# Altium project 1166V31.PrjPCB (part 2 of 2)

## Sheet 1166V31-4.SchDoc: Half-Bridge Phase 3
size A3; Author: M. Kutzsche; Organization: Kübrich Ing.-Gesellschaft; Address1: mbH & Co. KG; Address2: Weißmühle 10; Address3: D-96170 Priesendorf; DocumentNumber: UltraZohm; Revision: 31; SheetNumber: 4; SheetTotal: 5
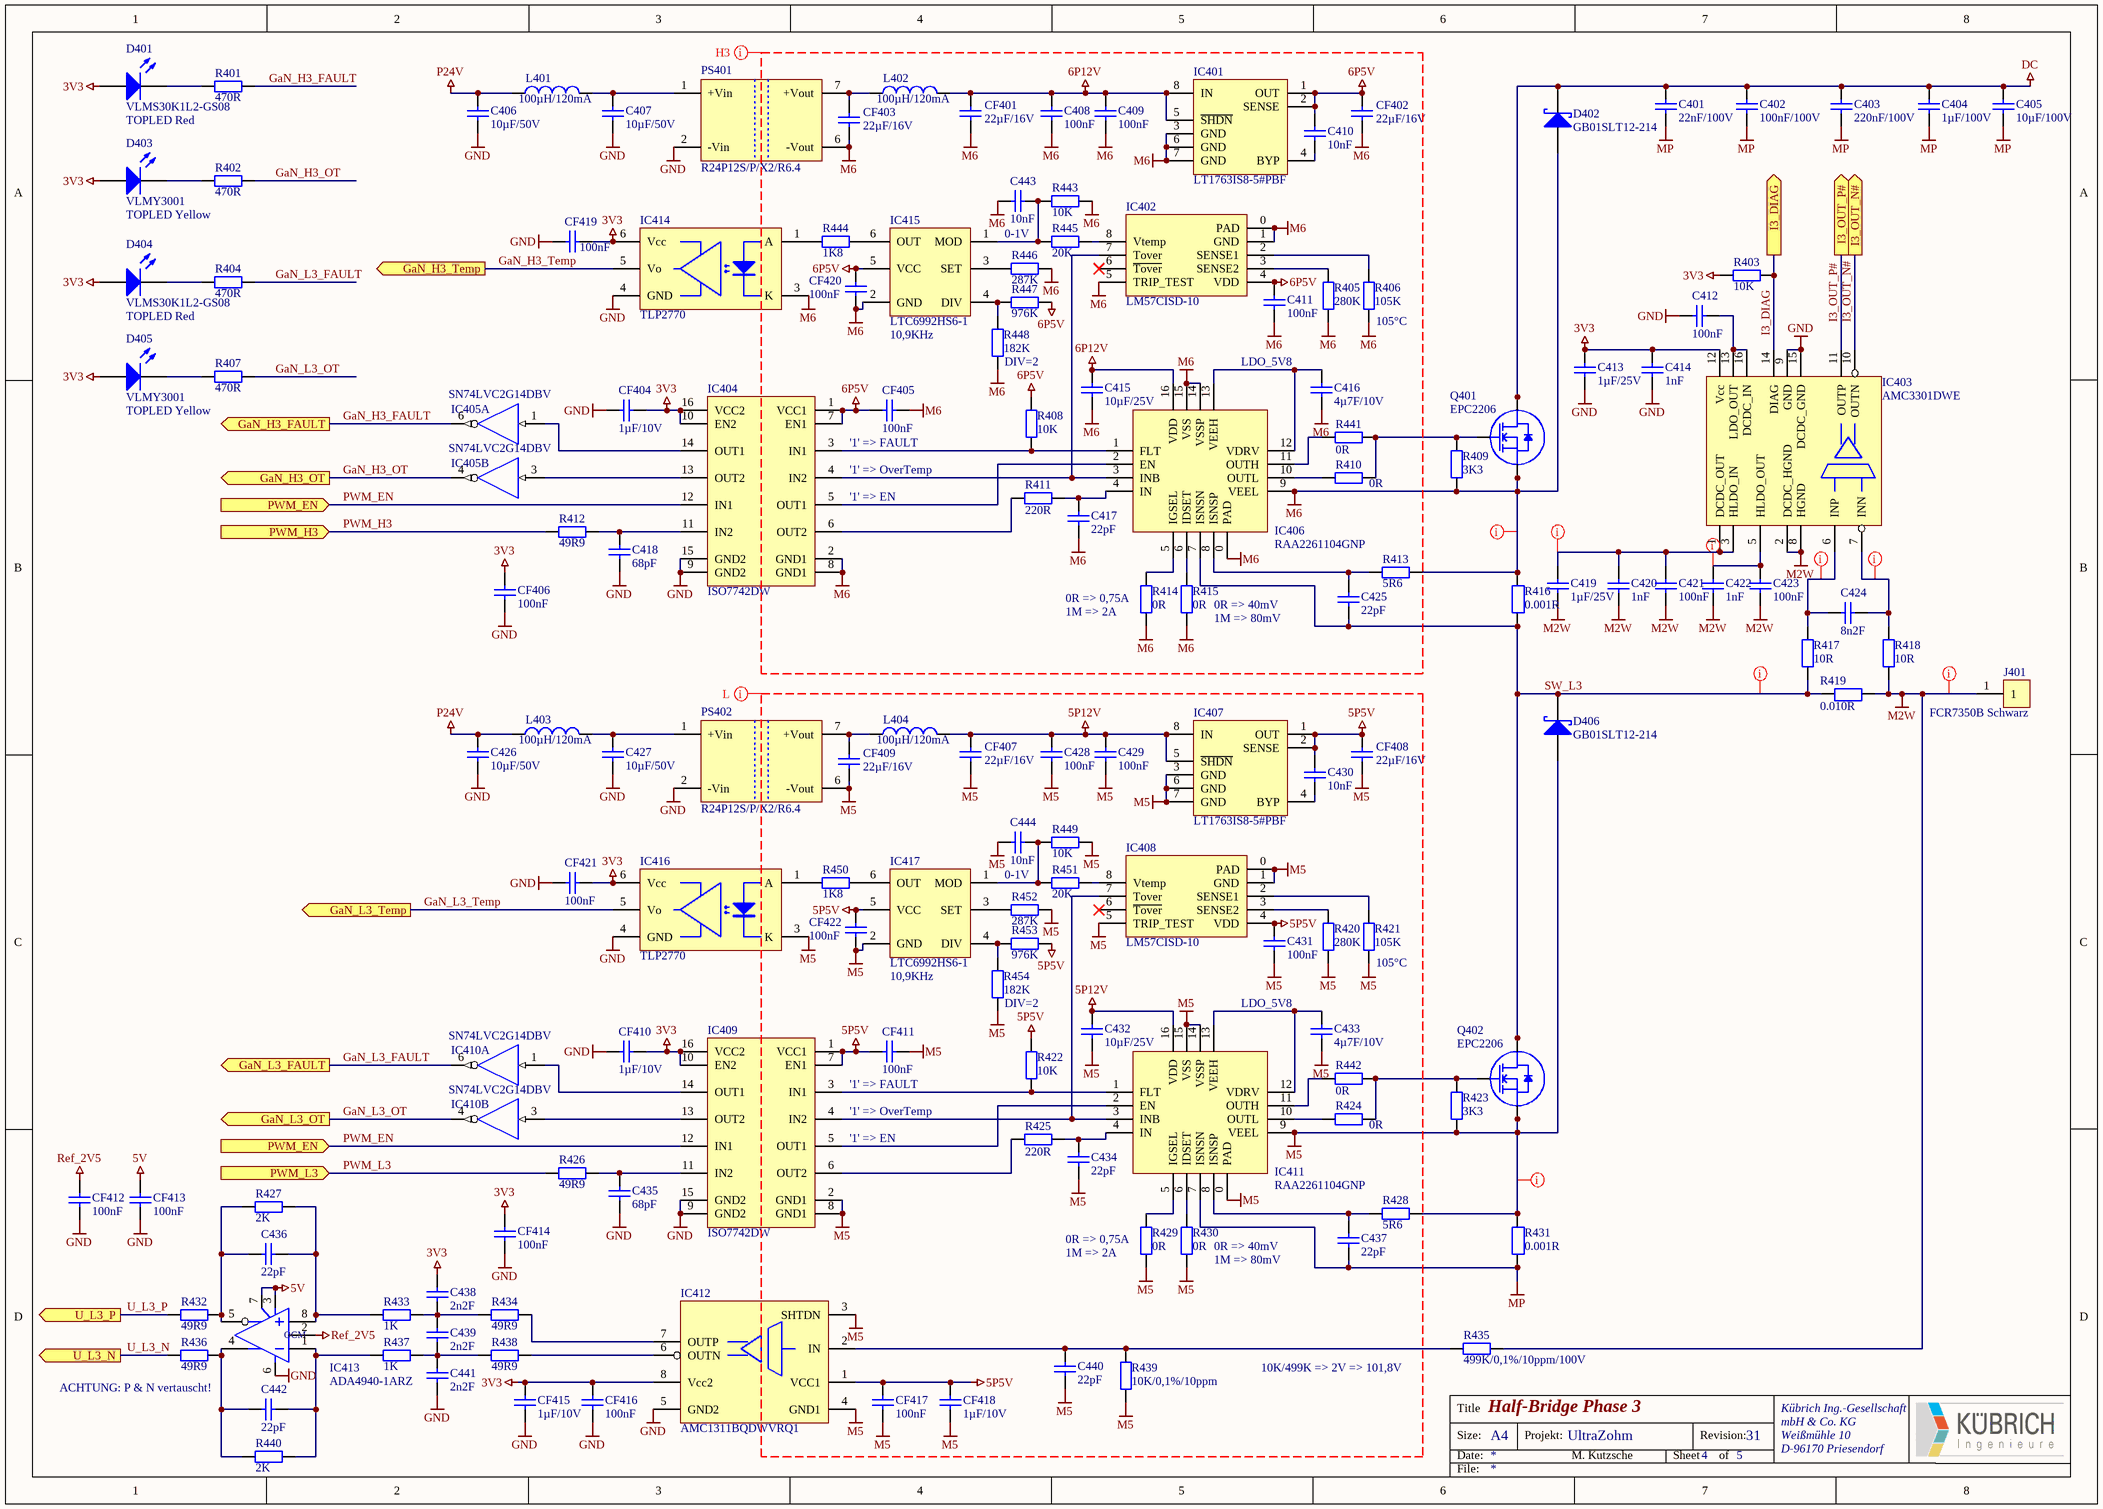
[diagram p3: 1166V31-4.SchDoc]

### Parts
C401  22nF/100V  [0805-Cap]
C402  100nF/100V  [0805-Cap]
C403  220nF/100V  [0805-Cap]
C404  1µF/100V  [0805-Cap]
C405  10µF/100V  [1210-Cap]
C406  10µF/50V  [1206-Cap]
C407  10µF/50V  [1206-Cap]
C408  100nF  [0603-Cap]
C409  100nF  [0603-Cap]
C410  10nF  [0603-Cap]
C411  100nF  [0603-Cap]
C412  100nF  [0603-Cap]
C413  1µF/25V  [1206-Cap]
C414  1nF  [1206-Cap]
C415  10µF/25V  [0805-Cap]
C416  4µ7F/10V  [0805-Cap]
C417  22pF  [0603-Cap]
C418  68pF  [0603-Cap]
C419  1µF/25V  [0603-Cap]
C420  1nF  [0603-Cap]
C421  100nF  [0603-Cap]
C422  1nF  [1206-Cap]
C423  100nF  [1206-Cap]
C424  8n2F  [0603-Cap]
C425  22pF  [0603-Cap]
C426  10µF/50V  [1206-Cap]
C427  10µF/50V  [1206-Cap]
C428  100nF  [0603-Cap]
C429  100nF  [0603-Cap]
C430  10nF  [0603-Cap]
C431  100nF  [0603-Cap]
C432  10µF/25V  [0805-Cap]
C433  4µ7F/10V  [0805-Cap]
C434  22pF  [0603-Cap]
C435  68pF  [0603-Cap]
C436  22pF  [0603-Cap]
C437  22pF  [0603-Cap]
C438  2n2F  [0603-Cap]
C439  2n2F  [0603-Cap]
C440  22pF  [0603-Cap]
C441  2n2F  [0603-Cap]
C442  22pF  [0603-Cap]
C443  10nF  [0603-Cap]
C444  10nF  [0603-Cap]
CF401  22µF/16V  [0805-Cap]
CF402  22µF/16V  [0805-Cap]
CF403  22µF/16V  [0805-Cap]
CF404  1µF/10V  [0603-Cap]
CF405  100nF  [0603-Cap]
CF406  100nF  [0603-Cap]
CF407  22µF/16V  [0805-Cap]
CF408  22µF/16V  [0805-Cap]
CF409  22µF/16V  [0805-Cap]
CF410  1µF/10V  [0603-Cap]
CF411  100nF  [0603-Cap]
CF412  100nF  [0603-Cap]
CF413  100nF  [0603-Cap]
CF414  100nF  [0603-Cap]
CF415  1µF/10V  [0603-Cap]
CF416  100nF  [0603-Cap]
CF417  100nF  [0603-Cap]
CF418  1µF/10V  [0603-Cap]
CF419  100nF  [0603-Cap]
CF420  100nF  [0603-Cap]
CF421  100nF  [0603-Cap]
CF422  100nF  [0603-Cap]
D401  VLMS30K1L2-GS08  Class II: TOPLED Red  [PLCC-2_rot]
D402  GB01SLT12-214  [DO-214 (SMB)]
D403  VLMY3001  Class II: TOPLED Yellow  [PLCC-2_gelb]
D404  VLMS30K1L2-GS08  Class II: TOPLED Red  [PLCC-2_rot]
D405  VLMY3001  Class II: TOPLED Yellow  [PLCC-2_gelb]
D406  GB01SLT12-214  [DO-214 (SMB)]
IC401  LT1763IS8-5#PBF  [SOIC-8-N]
IC402  LM57CISD-10  [WSON-8 (2.5x2.5mm)]
IC403  AMC3301DWE  [SOIC-16-W - 8.1mm]
IC404  ISO7742DW  [SOIC-16-W - 8.1mm]
IC405  SN74LVC2G14DBV  [SOT-23-6]  (parts A,B of 2)
IC406  RAA2261104GNP  [QFN-16 (4x4mm)]
IC407  LT1763IS8-5#PBF  [SOIC-8-N]
IC408  LM57CISD-10  [WSON-8 (2.5x2.5mm)]
IC409  ISO7742DW  [SOIC-16-W - 8.1mm]
IC410  SN74LVC2G14DBV  [SOT-23-6]  (parts A,B of 2)
IC411  RAA2261104GNP  [QFN-16 (4x4mm)]
IC412  AMC1311BQDWVRQ1  [SOIC-8-W]
IC413  ADA4940-1ARZ  [SOIC-8-N]
IC414  TLP2770  [SO-6L]
IC415  LTC6992HS6-1  [SOT-23-6]
IC416  TLP2770  [SO-6L]
IC417  LTC6992HS6-1  [SOT-23-6]
J401  FCR7350B Schwarz  [SLB4-I/90 - 4mm - Schwarz - CLIFF]
L401  100µH/120mA  [1007-IND (2518)]
L402  100µH/120mA  [1007-IND (2518)]
L403  100µH/120mA  [1007-IND (2518)]
L404  100µH/120mA  [1007-IND (2518)]
PS401  R24P12S/P/X2/R6.4  [SIP-7 Single - X2]
PS402  R24P12S/P/X2/R6.4  [SIP-7 Single - X2]
Q401  EPC2206  [D0232]
Q402  EPC2206  [D0232]
R401  470R  [0603-Res]
R402  470R  [0603-Res]
R403  10K  [0603-Res]
R404  470R  [0603-Res]
R405  280K  [0603-Res]
R406  105K  [0603-Res]
R407  470R  [0603-Res]
R408  10K  [0603-Res]
R409  3K3  [0603-Res]
R410  0R  [0603-Res]
R411  220R  [0603-Res]
R412  49R9  [0603-Res]
R413  5R6  [0603-Res]
R414  0R  [0603-Res]
R415  0R  [0603-Res]
R416  0.001R  [2512]
R417  10R  [0603-Res]
R418  10R  [0603-Res]
R419  0.010R  [GMR320]
R420  280K  [0603-Res]
R421  105K  [0603-Res]
R422  10K  [0603-Res]
R423  3K3  [0603-Res]
R424  0R  [0603-Res]
R425  220R  [0603-Res]
R426  49R9  [0603-Res]
R427  2K  [0603-Res]
R428  5R6  [0603-Res]
R429  0R  [0603-Res]
R430  0R  [0603-Res]
R431  0.001R  [2512]
R432  49R9  [0603-Res]
R433  1K  [0603-Res]
R434  49R9  [0603-Res]
R435  499K/0,1%/10ppm/100V  [0805-Res]
R436  49R9  [0603-Res]
R437  1K  [0603-Res]
R438  49R9  [0603-Res]
R439  10K/0,1%/10ppm  [0603-Res]
R440  2K  [0603-Res]
R441  0R  [0603-Res]
R442  0R  [0603-Res]
R443  10K  [0603-Res]
R444  1K8  [0603-Res]
R445  20K  [0603-Res]
R446  287K  [0603-Res]
R447  976K  [0603-Res]
R448  182K  [0603-Res]
R449  10K  [0603-Res]
R450  1K8  [0603-Res]
R451  20K  [0603-Res]
R452  287K  [0603-Res]
R453  976K  [0603-Res]
R454  182K  [0603-Res]

### Ports
GaN_H3_FAULT (out), GaN_H3_OT (out), GaN_H3_Temp (out), GaN_L3_FAULT (out), GaN_L3_OT (out), GaN_L3_Temp (out), I3_DIAG (out), I3_OUT_N# (out), I3_OUT_P# (out), PWM_EN (in), PWM_H3 (in), PWM_L3 (in), U_L3_N (out), U_L3_P (out)

### Nets
3V3: C413.1 C414.1 C438.2 CF404.1 CF406.1 CF410.1 CF414.1 CF415.1 CF416.1 CF419.2 CF421.2 D401.1(A) D403.1(A) D404.1(A) D405.1(A) IC403.12(Vcc) IC404.10(EN2) IC404.16(VCC2) IC405.5(VCC) IC409.10(EN2) IC409.16(VCC2) IC410.5(VCC) IC412.8(Vcc2) IC414.6(Vcc) IC416.6(Vcc) R403.2  [also labelled VCC]
5P5V: C430.1 C431.1 CF408.1 CF411.2 CF417.1 CF418.1 CF422.1 IC407.1(OUT) IC407.2(SENSE) IC408.4(VDD) IC409.1(VCC1) IC409.7(EN1) IC412.1(VCC1) IC417.5(VCC) R422.1 R453.1
5P12V: C428.1 C429.1 C432.2 CF407.1 IC407.5(~{SHDN}) IC407.8(IN) IC411.16(VDD) L404.2
5V: CF413.1 IC413.3(V+) IC413.7(EN)
6P5V: C410.1 C411.1 CF402.1 CF405.2 CF420.1 IC401.1(OUT) IC401.2(SENSE) IC402.4(VDD) IC404.1(VCC1) IC404.7(EN1) IC415.5(VCC) R408.1 R447.1
6P12V: C408.1 C409.1 C415.2 CF401.1 IC401.5(~{SHDN}) IC401.8(IN) IC406.16(VDD) L402.2
DC: C401.1 C402.1 C403.1 C404.1 C405.1 D402.2(K) Q401.3(D1) Q401.4(D2) Q401.7(D3) Q401.8(D4) Q401.11(D5) Q401.12(D6) Q401.15(D7) Q401.16(D8) Q401.19(D9) Q401.20(D10) Q401.23(D11) Q401.24(D12) Q401.27(D13) Q401.28(D14)
GND: C406.1 C407.1 C412.1 C413.2 C414.2 C418.1 C426.1 C427.1 C435.1 C441.1 CF404.2 CF406.2 CF410.2 CF412.2 CF413.2 CF414.2 CF415.2 CF416.2 CF419.1 CF421.1 IC403.9(GND) IC403.15(DCDC_GND) IC404.9(GND2) IC404.15(GND2) IC405.2(GND) IC409.9(GND2) IC409.15(GND2) IC410.2(GND) IC412.5(GND2) IC413.6(V-) IC414.4(GND) IC416.4(GND) PS401.2(-Vin) PS402.2(-Vin)
M2W: C419.2 C420.2 C421.2 C422.2 C423.2 IC403.2(DCDC_HGND) IC403.8(HGND) J401.1 R418.1 R419.1 R435.2
M5: C428.2 C429.2 C431.2 C432.1 C433.2 C434.1 C440.1 C444.1 CF407.2 CF408.2 CF409.2 CF411.1 CF417.2 CF418.2 CF422.2 D406.1(A) IC407.3(GND) IC407.6(GND) IC407.7(GND) IC408.0(PAD) IC408.1(GND) IC408.5(TRIP_TEST) IC409.2(GND1) IC409.8(GND1) IC411.0(PAD) IC411.9(VEEL) IC411.14(VSSP) IC411.15(VSS) IC412.3(SHTDN) IC412.4(GND1) IC416.3(K) IC417.2(GND) PS402.6(-Vout) Q402.2(S1) Q402.5(S2) Q402.6(S3) Q402.9(S4) Q402.10(S5) Q402.13(S6) Q402.14(S7) Q402.17(S8) Q402.18(S9) Q402.21(S10) Q402.22(S11) Q402.25(S12) Q402.26(S13) Q402.29(S14) Q402.30(Sub) R420.2 R421.2 R423.1 R428.2 R429.2 R430.2 R431.2 R439.2 R449.1 R452.1 R454.1
M6: C408.2 C409.2 C411.2 C415.1 C416.2 C417.1 C443.1 CF401.2 CF402.2 CF403.2 CF405.1 CF420.2 D402.1(A) IC401.3(GND) IC401.6(GND) IC401.7(GND) IC402.0(PAD) IC402.1(GND) IC402.5(TRIP_TEST) IC404.2(GND1) IC404.8(GND1) IC406.0(PAD) IC406.9(VEEL) IC406.14(VSSP) IC406.15(VSS) IC414.3(K) IC415.2(GND) PS401.6(-Vout) Q401.2(S1) Q401.5(S2) Q401.6(S3) Q401.9(S4) Q401.10(S5) Q401.13(S6) Q401.14(S7) Q401.17(S8) Q401.18(S9) Q401.21(S10) Q401.22(S11) Q401.25(S12) Q401.26(S13) Q401.29(S14) Q401.30(Sub) R405.2 R406.2 R409.1 R413.2 R414.2 R415.2 R416.2 R443.1 R446.1 R448.1
MP: C401.2 C402.2 C403.2 C404.2 C405.2 C437.1 IC411.7(ISNSN) R431.1
P24V: C406.2 C426.2 L401.1 L403.1
Ref_2V5: CF412.1 IC413.2(OCM)
GaN_H3_FAULT: IC405.6(1Y) R401.2 ; port GaN_H3_FAULT
GaN_H3_OT: IC405.4(2Y) R402.2 ; port GaN_H3_OT
GaN_H3_Temp: IC414.5(Vo) ; port GaN_H3_Temp
GaN_L3_FAULT: IC410.6(1Y) R404.2 ; port GaN_L3_FAULT
GaN_L3_OT: IC410.4(2Y) R407.2 ; port GaN_L3_OT
GaN_L3_Temp: IC416.5(Vo) ; port GaN_L3_Temp
I3_DIAG: IC403.14(DIAG) R403.1 ; port I3_DIAG
I3_OUT_N#: IC403.10(OUTN) ; port I3_OUT_N#
I3_OUT_P#: IC403.11(OUTP) ; port I3_OUT_P#
PWM_EN: IC404.12(IN1) IC409.12(IN1) ; port PWM_EN
PWM_H3: R412.2 ; port PWM_H3
PWM_L3: R426.2 ; port PWM_L3
SW_L3: C425.1 D406.2(K) IC406.7(ISNSN) Q402.3(D1) Q402.4(D2) Q402.7(D3) Q402.8(D4) Q402.11(D5) Q402.12(D6) Q402.15(D7) Q402.16(D8) Q402.19(D9) Q402.20(D10) Q402.23(D11) Q402.24(D12) Q402.27(D13) Q402.28(D14) R416.1 R417.1 R419.2
U_L3_N: R436.2 ; port U_L3_N
U_L3_P: R432.2 ; port U_L3_P
NetC407_2: C407.2 L401.2 PS401.1(+Vin)
NetC410_2: C410.2 IC401.4(BYP)
NetC412_2: C412.2 IC403.13(LDO_OUT) IC403.16(DCDC_IN)
NetC416_1: C416.1 IC406.12(VDRV) IC406.13(VEEH)
NetC417_2: C417.2 IC406.4(IN) R411.1
NetC418_2: C418.2 IC404.11(IN2) R412.1
NetC419_1: C419.1 C420.1 C421.1 IC403.1(DCDC_OUT) IC403.3(HLDO_IN)
NetC422_1: C422.1 C423.1 IC403.5(HLDO_OUT)
NetC424_1: C424.1 IC403.7(INN) R418.2
NetC424_2: C424.2 IC403.6(INP) R417.2
NetC425_2: C425.2 IC406.8(ISNSP) R413.1
NetC427_2: C427.2 L403.2 PS402.1(+Vin)
NetC430_2: C430.2 IC407.4(BYP)
NetC433_1: C433.1 IC411.12(VDRV) IC411.13(VEEH)
NetC434_2: C434.2 IC411.4(IN) R425.1
NetC435_2: C435.2 IC409.11(IN2) R426.1
NetC436_1: C436.1 IC413.8(+) R427.1 R433.2
NetC436_2: C436.2 IC413.5(Out) R427.2 R432.1
NetC437_2: C437.2 IC411.8(ISNSP) R428.1
NetC438_1: C438.1 C439.2 R433.1 R434.2
NetC439_1: C439.1 C441.2 R437.1 R438.2
NetC440_2: C440.2 IC412.2(IN) R435.1 R439.1
NetC442_1: C442.1 IC413.1(-) R437.2 R440.1
NetC442_2: C442.2 IC413.4(Out) R436.1 R440.2
NetC443_2: C443.2 IC415.1(MOD) R443.2 R445.1
NetC444_2: C444.2 IC417.1(MOD) R449.2 R451.1
NetCF403_1: CF403.1 L402.1 PS401.7(+Vout)
NetCF409_1: CF409.1 L404.1 PS402.7(+Vout)
NetD401_2: D401.2(K) R401.1
NetD403_2: D403.2(K) R402.1
NetD404_2: D404.2(K) R404.1
NetD405_2: D405.2(K) R407.1
NetIC402_2: IC402.2(SENSE1) R406.1
NetIC402_3: IC402.3(SENSE2) R405.1
NetIC402_7: IC402.7(Tover) IC404.4(IN2) IC406.3(INB)
NetIC402_8: IC402.8(Vtemp) R445.2
NetIC404_3: IC404.3(IN1) IC406.1(FLT) R408.2
NetIC404_5: IC404.5(OUT1) IC406.2(EN)
NetIC404_6: IC404.6(OUT2) R411.2
NetIC404_13: IC404.13(OUT2) IC405.3(2A)
NetIC404_14: IC404.14(OUT1) IC405.1(1A)
NetIC406_5: IC406.5(IGSEL) R414.1
NetIC406_6: IC406.6(IDSET) R415.1
NetIC406_10: IC406.10(OUTL) R410.1
NetIC406_11: IC406.11(OUTH) R441.1
NetIC408_2: IC408.2(SENSE1) R421.1
NetIC408_3: IC408.3(SENSE2) R420.1
NetIC408_7: IC408.7(Tover) IC409.4(IN2) IC411.3(INB)
NetIC408_8: IC408.8(Vtemp) R451.2
NetIC409_3: IC409.3(IN1) IC411.1(FLT) R422.2
NetIC409_5: IC409.5(OUT1) IC411.2(EN)
NetIC409_6: IC409.6(OUT2) R425.2
NetIC409_13: IC409.13(OUT2) IC410.3(2A)
NetIC409_14: IC409.14(OUT1) IC410.1(1A)
NetIC411_5: IC411.5(IGSEL) R429.1
NetIC411_6: IC411.6(IDSET) R430.1
NetIC411_10: IC411.10(OUTL) R424.1
NetIC411_11: IC411.11(OUTH) R442.1
NetIC412_6: IC412.6(OUTN) R438.1
NetIC412_7: IC412.7(OUTP) R434.1
NetIC414_1: IC414.1(A) R444.2
NetIC415_3: IC415.3(SET) R446.2
NetIC415_4: IC415.4(DIV) R447.2 R448.2
NetIC415_6: IC415.6(OUT) R444.1
NetIC416_1: IC416.1(A) R450.2
NetIC417_3: IC417.3(SET) R452.2
NetIC417_4: IC417.4(DIV) R453.2 R454.2
NetIC417_6: IC417.6(OUT) R450.1
NetQ401_1: Q401.1(G) R409.2 R410.2 R441.2
NetQ402_1: Q402.1(G) R423.2 R424.2 R442.2

Not connected (* = marked no-connect by the designer): IC402 6(~{Tover})*; IC408 6(~{Tover})*

### Layout directives
net class H3: 6P5V, 6P12V, M2W, M6, NetC419_1, NetC422_1, NetC424_1, NetC424_2, SW_L3
net class L: 5P5V, 5P12V, M5

### Notes on the sheet
- 0-1V
- (near IC415) 10,9KHz
- (near R448) DIV=2
- LDO_5V8
- (near R406) 105°C
- '1' => FAULT
- '1' => OverTemp
- (near IC404) '1' => EN
- (near R414) 1M => 2A
- (near R414) 0R => 0,75A
- (near R415) 0R => 40mV
- (near R415) 1M => 80mV
- (near IC417) 10,9KHz
- (near R421) 105°C
- (near R454) DIV=2
- (near IC409) '1' => EN
- (near R429) 1M => 2A
- (near R429) 0R => 0,75A
- (near R430) 0R => 40mV
- (near R430) 1M => 80mV
- ACHTUNG: P & N vertauscht!
- 10K/499K => 2V => 101,8V
- Title
- Size:
- Date:
- A4
- Projekt:
- Sheet
- Revision:
- of
- File:

### Library data of the parts
C401-C444 CF401-CF422 = Cap_SMD: Capacitor (SMD); Class I: Pasiv; Class II: Capacitor; Last edited: 20.11.2006 10:25
  C401: value: 22nF/100V
  C402: value: 100nF/100V
  C403: value: 220nF/100V
  C404: value: 1µF/100V
  C405: value: 10µF/100V
  C406 C407 C426 C427: value: 10µF/50V
  C408 C409 C411 C412 C421 C423 C428 C429 C431 CF405 CF406 CF411-CF414 CF416 CF417 CF419-CF422: value: 100nF
  C410 C430 C443 C444: value: 10nF
  C413 C419: value: 1µF/25V
  C414 C420 C422: value: 1nF
  C415 C432: value: 10µF/25V
  C416 C433: value: 4µ7F/10V
  C417 C425 C434 C436 C437 C440 C442: value: 22pF
  C418 C435: value: 68pF
  C424: value: 8n2F
  C438 C439 C441: value: 2n2F
  CF401-CF403 CF407-CF409: value: 22µF/16V
  CF404 CF410 CF415 CF418: value: 1µF/10V
D401 D404 = VLMS30K1L2-GS08: Top LED Super red, 2mA, 18mcd, -40-100°C; Manufacturer: Vishay; Class I: Discrete; Best.-Nr.: Farnell 132-8349; Last edited: 23.01.2007 08:58
D402 D406 = GB01SLT12-214: Silicon Carbide Schottky Diode Vr=1200V If=1A; Manufacturer: GeneSiC Semiconductor; Class I: Discret; Package information: Unknown; Best.-Nr.: DigiKey: 1242-1169-1-ND; Class II: Silicon Carbide Schottky Diode Vr=1200V If=1A; Datasheet: Ver. 7 Nov 2000; Package reference: DO-214AA (SMB)
D403 D405 = VLMY3001: Top LED Yellow, 2mA, 18mcd, -40-100°C; Manufacturer: Vishay; Class I: Discrete; Best.-Nr.: ???; Last edited: 23.01.2007 08:58
IC401 IC407 = LT1763IS8-5#PBF: LDO 5V/500mA, Vin 20V (-40-125°C); Manufacturer: Linear Technology; Class I: Discret; Package information: Unknown; Best.-Nr.: Farnell 229-5214; Class II: LDO 5V/500mA, Vin 20V (-40-125°C); Datasheet: ???; Package reference: SO-8
IC402 IC408 = LM57CISD-10: Temperature Sensor/Switch -40 - 150°C, Resistor-Programmable, 10°C Hysterese; Manufacturer: Texas Instruments; Class I: Sensor; Best.-Nr.: DigiKey: LM57CISD-10/NOPBCT-ND; Class II: Temperature Sensor/Switch -40 - 150°C, Resistor-Programmable, 10°C Hysterese
IC403 = AMC3301DWE: ±250 mV Input Voltage Range, Reinforced Isolated Amplifier and High Bandwidth of 300 kHz; Manufacturer: Texas Instruments; Class II: ±250 mV, 300KHz, -40-125°C; Package information: Unknown; Best.-Nr.: DigiKey: 296-AMC3301DWE-ND; Class I: Isolated Amplifier; Datasheet: Unknown; Package reference: SOIC-16-W
IC404 IC409 = ISO7742DW: Quad-CH 100Mbps Isolators 2 IN/2 OUT, 5000V Reinforced, (-40-125°C); Manufacturer: Texas Instruments; Class I: Optocoupler; Package information: Unknown; Best.-Nr.: DigiKey: 296-44609-1-ND; Class II: Quad-CH 100Mbps Isolators 2 IN/2 OUT, 5000V Reinforced, (-40-125°C); Datasheet: Unknown; Package reference: SOIC-16W
IC405 IC410 = SN74LVC2G14D_: Dual Inverter with Schmitt Trigger Input; Manufacturer: Texas Instrument; Class I: Logic; value121: SN74LVC2G14DCK; Datasheet: SCES200J; Class II: Dual Inverter with Schmitt Trigger Input; value111: SN74LVC2G14DBV; Last edited: 22.01.2007 11:08
IC406 IC411 = RAA2261104GNP: Low -Side GaN FET-Driver, 6,5V - 18V; Manufacturer: Renesas; Class I: Discret; Package information: Unknown; Best.-Nr.: Mouser: 968-2261104GNP#AA0; Class II: Low -Side GaN FET-Driver, 6,5V - 18V; Datasheet: Rev. Mar 2002; Package reference: QFN-16
IC412 = AMC1311BQDWVRQ1: 2V Input, Automotive High-Impedance, Reinforced Isolated Amplifier for Voltage Sensing; Manufacturer: Texas Instruments; Class II: 2V, 275KHz, -40-125°C; Package information: Unknown; Best.-Nr.: Mouser: 595-AMC1311BQDWVRQ1; Class I: Isolated Amplifier; Datasheet: Unknown; Package reference: SOIC-8-W
IC413 = ADA4940-1ARZ: Fully Differential ADC Drivers (-40-125°C); Manufacturer: ANALOG DEVICES; Class I: Analog; Best.-Nr.: Farnell 209-6178; Class II: Fully Differential ADC Drivers (-40-125°C); Datasheet: DSO11449, Ver. Aug 2000; Last edited: 04.01.2007 10:14; Package Reference: SOIC-N-8
IC414 IC416 = TLP2770: High-speed 20Mbps Logic Gate Optocoupler; Manufacturer: Toshiba; Package information: Unknown; Best.-Nr.: DigiKey: TLP2770; Class II: High-speed 20Mbps Logic Gate Optocoupler; Class I: Optocoupler; Package reference: SO-6L
IC415 IC417 = LTC6992HS6-1: Analog to PWM Converter 0-100%, -40-125°C; Manufacturer: Analog Device; Best.-Nr.: Mouser: 584-C6992HS6-1TRMPBF; Published: 24-Mar-1999; Revision: July-2002: Re-released for DXP Platform.; Publisher: Altium Limited
J401 = FCR7350B Schwarz: Labor Winkelbuchsen 4mm Schwarz; Manufacturer: CLIFF Electronic; Class I: Connectors; Best.-Nr.: Farnell: 185-4507; Class II: Labor Winkelbuchsen 4mm Schwarz; Last edited: 07.03.2007 13:28
L401-L404 = CB2518T101K: 100µH, 60/120mA. (1007), -40-105°C; Manufacturer: Taiyo Yuden; Class I: Pasive; Best.-Nr.: DigiKey:   587-2192-1-ND; Class II: 100µH, 60/120mA. (1007), -40-105°C; Last edited: 08.12.2006 12:28
PS401 PS402 = R24P12S/P/X2/R6.4: DC/DC Converter 24V to 12V, 1W, 84mA (unregulated) 6,4KVDC Rainforced; Manufacturer: Recom; Class I: Analog; Package information: Unknown; Best.-Nr.: Mouser: 919-R24P12SX2PR6.4; Class II: DC/DC Converter 24V to 12V, 1W, 84mA (unregulated) 6,4KVDC Rainforced; Package reference: SIP-7; Datasheet: Rev. 28 Apr 2002
Q401 Q402 = EPC2206: GaN-Fet 80V, 2.2mOhm, 90A; Manufacturer: EPC; Class I: Discret; Package information: Unknown; Best.-Nr.: DigiKey: 917-1212-1-ND; Class II: GaN-Fet 80V, 2.2mOhm, 90A; Datasheet: Rev. Mar 2002; Package reference: DIE
R401-R415 R417 R418 R420-R430 R432-R454 = Res_SMD: Resistor SMD; Class I: Pasiv; Class II: Resistor; Last edited: 17.11.2006 11:38
  R401 R402 R404 R407: value: 470R
  R403 R408 R422 R443 R449: value: 10K
  R405 R420: value: 280K
  R406 R421: value: 105K
  R409 R423: value: 3K3
  R410 R414 R415 R424 R429 R430 R441 R442: value: 0R
  R411 R425: value: 220R
  R412 R426 R432 R434 R436 R438: value: 49R9
  R413 R428: value: 5R6
  R417 R418: value: 10R
  R427 R440: value: 2K
  R433 R437: value: 1K
  R435: value: 499K/0,1%/10ppm/100V
  R439: value: 10K/0,1%/10ppm
  R444 R450: value: 1K8
  R445 R451: value: 20K
  R446 R452: value: 287K
  R447 R453: value: 976K
  R448 R454: value: 182K
R416 R431 = CSS2H-2512R-1L00F: Shunt 0.001R, 5W, 1%, 50ppm/°C; Manufacturer: Bourns; Class I: Pasiv; Class II: Shunt 5W; Best.-Nr.: Farnell 257-6347; Last edited: 23.11.2010 14:12; value: 0.001R
R419 = GMR320HJBFA10L0: Shunt 0.010R, 10W, 1%, 25ppm; Manufacturer: ROHM; Class I: Pasiv; Class II: Shunt 10W; Best.-Nr.: DigiKey 511-GMR320HJBFA10L0CT-ND; Mouser: 755-GMR320HJBFA10L0; Last edited: 23.11.2006 14:12; value: 0.010R

## Sheet 1166V31-5.SchDoc: HV-Input & Measurement-Driver
size A3; Author: M. Kutzsche; Organization: Kübrich Ing.-Gesellschaft; Address1: mbH & Co. KG; Address2: Weißmühle 10; Address3: D-96170 Priesendorf; DocumentNumber: UltraZohm; Revision: 31; SheetNumber: 5; SheetTotal: 5
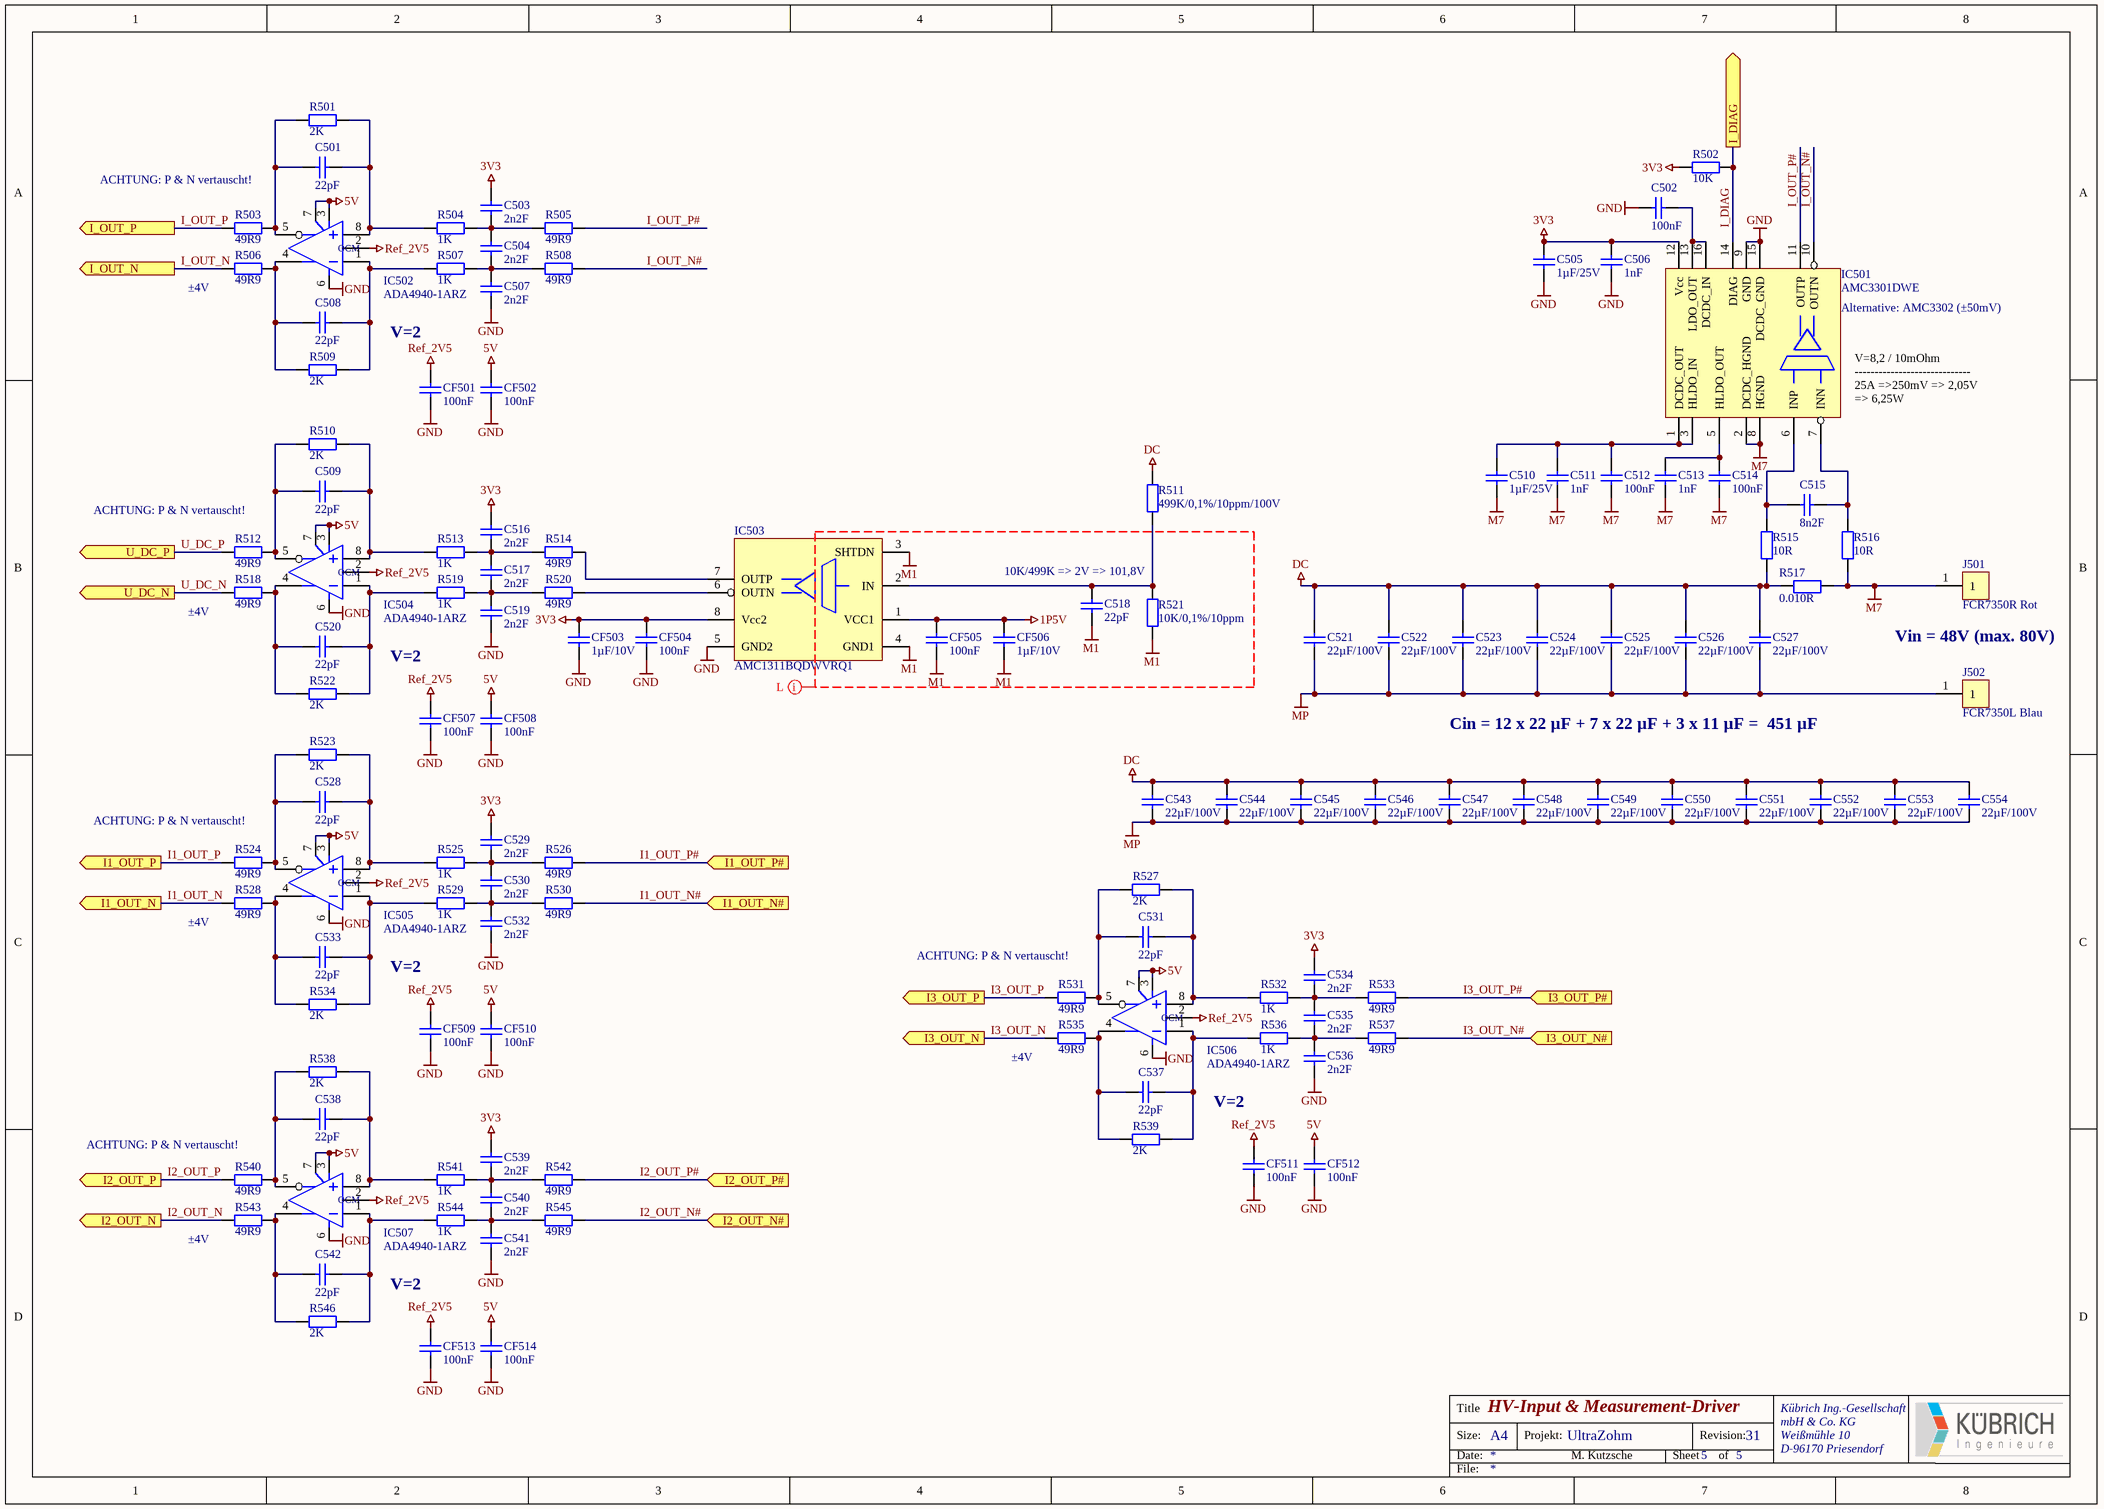
[diagram p4: 1166V31-5.SchDoc]

### Parts
C501  22pF  [0603-Cap]
C502  100nF  [0603-Cap]
C503  2n2F  [0603-Cap]
C504  2n2F  [0603-Cap]
C505  1µF/25V  [1206-Cap]
C506  1nF  [1206-Cap]
C507  2n2F  [0603-Cap]
C508  22pF  [0603-Cap]
C509  22pF  [0603-Cap]
C510  1µF/25V  [0603-Cap]
C511  1nF  [0603-Cap]
C512  100nF  [0603-Cap]
C513  1nF  [1206-Cap]
C514  100nF  [1206-Cap]
C515  8n2F  [0603-Cap]
C516  2n2F  [0603-Cap]
C517  2n2F  [0603-Cap]
C518  22pF  [0603-Cap]
C519  2n2F  [0603-Cap]
C520  22pF  [0603-Cap]
C521  22µF/100V  [2220-Cap]
C522  22µF/100V  [2220-Cap]
C523  22µF/100V  [2220-Cap]
C524  22µF/100V  [2220-Cap]
C525  22µF/100V  [2220-Cap]
C526  22µF/100V  [2220-Cap]
C527  22µF/100V  [2220-Cap]
C528  22pF  [0603-Cap]
C529  2n2F  [0603-Cap]
C530  2n2F  [0603-Cap]
C531  22pF  [0603-Cap]
C532  2n2F  [0603-Cap]
C533  22pF  [0603-Cap]
C534  2n2F  [0603-Cap]
C535  2n2F  [0603-Cap]
C536  2n2F  [0603-Cap]
C537  22pF  [0603-Cap]
C538  22pF  [0603-Cap]
C539  2n2F  [0603-Cap]
C540  2n2F  [0603-Cap]
C541  2n2F  [0603-Cap]
C542  22pF  [0603-Cap]
C543  22µF/100V  [2220-Cap]
C544  22µF/100V  [2220-Cap]
C545  22µF/100V  [2220-Cap]
C546  22µF/100V  [2220-Cap]
C547  22µF/100V  [2220-Cap]
C548  22µF/100V  [2220-Cap]
C549  22µF/100V  [2220-Cap]
C550  22µF/100V  [2220-Cap]
C551  22µF/100V  [2220-Cap]
C552  22µF/100V  [2220-Cap]
C553  22µF/100V  [2220-Cap]
C554  22µF/100V  [2220-Cap]
CF501  100nF  [0603-Cap]
CF502  100nF  [0603-Cap]
CF503  1µF/10V  [0603-Cap]
CF504  100nF  [0603-Cap]
CF505  100nF  [0603-Cap]
CF506  1µF/10V  [0603-Cap]
CF507  100nF  [0603-Cap]
CF508  100nF  [0603-Cap]
CF509  100nF  [0603-Cap]
CF510  100nF  [0603-Cap]
CF511  100nF  [0603-Cap]
CF512  100nF  [0603-Cap]
CF513  100nF  [0603-Cap]
CF514  100nF  [0603-Cap]
IC501  AMC3301DWE  [SOIC-16-W - 8.1mm]
IC502  ADA4940-1ARZ  [SOIC-8-N]
IC503  AMC1311BQDWVRQ1  [SOIC-8-W]
IC504  ADA4940-1ARZ  [SOIC-8-N]
IC505  ADA4940-1ARZ  [SOIC-8-N]
IC506  ADA4940-1ARZ  [SOIC-8-N]
IC507  ADA4940-1ARZ  [SOIC-8-N]
J501  FCR7350R Rot  [SLB4-I/90 - 4mm - rot - CLIFF]
J502  FCR7350L Blau  [SLB4-I/90 - 4mm - Blau - CLIFF]
R501  2K  [0603-Res]
R502  10K  [0603-Res]
R503  49R9  [0603-Res]
R504  1K  [0603-Res]
R505  49R9  [0603-Res]
R506  49R9  [0603-Res]
R507  1K  [0603-Res]
R508  49R9  [0603-Res]
R509  2K  [0603-Res]
R510  2K  [0603-Res]
R511  499K/0,1%/10ppm/100V  [0805-Res]
R512  49R9  [0603-Res]
R513  1K  [0603-Res]
R514  49R9  [0603-Res]
R515  10R  [0603-Res]
R516  10R  [0603-Res]
R517  0.010R  [GMR320]
R518  49R9  [0603-Res]
R519  1K  [0603-Res]
R520  49R9  [0603-Res]
R521  10K/0,1%/10ppm  [0603-Res]
R522  2K  [0603-Res]
R523  2K  [0603-Res]
R524  49R9  [0603-Res]
R525  1K  [0603-Res]
R526  49R9  [0603-Res]
R527  2K  [0603-Res]
R528  49R9  [0603-Res]
R529  1K  [0603-Res]
R530  49R9  [0603-Res]
R531  49R9  [0603-Res]
R532  1K  [0603-Res]
R533  49R9  [0603-Res]
R534  2K  [0603-Res]
R535  49R9  [0603-Res]
R536  1K  [0603-Res]
R537  49R9  [0603-Res]
R538  2K  [0603-Res]
R539  2K  [0603-Res]
R540  49R9  [0603-Res]
R541  1K  [0603-Res]
R542  49R9  [0603-Res]
R543  49R9  [0603-Res]
R544  1K  [0603-Res]
R545  49R9  [0603-Res]
R546  2K  [0603-Res]

### Ports
I1_OUT_N (out), I1_OUT_N# (in), I1_OUT_P (out), I1_OUT_P# (in), I2_OUT_N (out), I2_OUT_N# (in), I2_OUT_P (out), I2_OUT_P# (in), I3_OUT_N (out), I3_OUT_N# (in), I3_OUT_P (out), I3_OUT_P# (in), I_DIAG (out), I_OUT_N (out), I_OUT_P (out), U_DC_N (out), U_DC_P (out)

### Nets
1P5V: CF505.1 CF506.1 IC503.1(VCC1)
3V3: C503.2 C505.1 C506.1 C516.2 C529.2 C534.2 C539.2 CF503.1 CF504.1 IC501.12(Vcc) IC503.8(Vcc2) R502.2
5V: CF502.1 CF508.1 CF510.1 CF512.1 CF514.1 IC502.3(V+) IC502.7(EN) IC504.3(V+) IC504.7(EN) IC505.3(V+) IC505.7(EN) IC506.3(V+) IC506.7(EN) IC507.3(V+) IC507.7(EN)
DC: C521.1 C522.1 C523.1 C524.1 C525.1 C526.1 C527.1 C543.1 C544.1 C545.1 C546.1 C547.1 C548.1 C549.1 C550.1 C551.1 C552.1 C553.1 C554.1 R511.2 R515.1 R517.2
GND: C502.1 C505.2 C506.2 C507.1 C519.1 C532.1 C536.1 C541.1 CF501.2 CF502.2 CF503.2 CF504.2 CF507.2 CF508.2 CF509.2 CF510.2 CF511.2 CF512.2 CF513.2 CF514.2 IC501.9(GND) IC501.15(DCDC_GND) IC502.6(V-) IC503.5(GND2) IC504.6(V-) IC505.6(V-) IC506.6(V-) IC507.6(V-)
M1: C518.1 CF505.2 CF506.2 IC503.3(SHTDN) IC503.4(GND1) R521.2
M7: C510.2 C511.2 C512.2 C513.2 C514.2 IC501.2(DCDC_HGND) IC501.8(HGND) J501.1 R516.1 R517.1
MP: C521.2 C522.2 C523.2 C524.2 C525.2 C526.2 C527.2 C543.2 C544.2 C545.2 C546.2 C547.2 C548.2 C549.2 C550.2 C551.2 C552.2 C553.2 C554.2 J502.1
Ref_2V5: CF501.1 CF507.1 CF509.1 CF511.1 CF513.1 IC502.2(OCM) IC504.2(OCM) IC505.2(OCM) IC506.2(OCM) IC507.2(OCM)
I1_OUT_N: R528.2 ; port I1_OUT_N
I1_OUT_N#: R530.1 ; port I1_OUT_N#
I1_OUT_P: R524.2 ; port I1_OUT_P
I1_OUT_P#: R526.1 ; port I1_OUT_P#
I2_OUT_N: R543.2 ; port I2_OUT_N
I2_OUT_N#: R545.1 ; port I2_OUT_N#
I2_OUT_P: R540.2 ; port I2_OUT_P
I2_OUT_P#: R542.1 ; port I2_OUT_P#
I3_OUT_N: R535.2 ; port I3_OUT_N
I3_OUT_N#: R537.1 ; port I3_OUT_N#
I3_OUT_P: R531.2 ; port I3_OUT_P
I3_OUT_P#: R533.1 ; port I3_OUT_P#
I_DIAG: IC501.14(DIAG) R502.1 ; port I_DIAG
I_OUT_N: R506.2 ; port I_OUT_N
I_OUT_N#: IC501.10(OUTN) R508.1
I_OUT_P: R503.2 ; port I_OUT_P
I_OUT_P#: IC501.11(OUTP) R505.1
U_DC_N: R518.2 ; port U_DC_N
U_DC_P: R512.2 ; port U_DC_P
NetC501_1: C501.1 IC502.8(+) R501.1 R504.2
NetC501_2: C501.2 IC502.5(Out) R501.2 R503.1
NetC502_2: C502.2 IC501.13(LDO_OUT) IC501.16(DCDC_IN)
NetC503_1: C503.1 C504.2 R504.1 R505.2
NetC504_1: C504.1 C507.2 R507.1 R508.2
NetC508_1: C508.1 IC502.1(-) R507.2 R509.1
NetC508_2: C508.2 IC502.4(Out) R506.1 R509.2
NetC509_1: C509.1 IC504.8(+) R510.1 R513.2
NetC509_2: C509.2 IC504.5(Out) R510.2 R512.1
NetC510_1: C510.1 C511.1 C512.1 IC501.1(DCDC_OUT) IC501.3(HLDO_IN)
NetC513_1: C513.1 C514.1 IC501.5(HLDO_OUT)
NetC515_1: C515.1 IC501.7(INN) R516.2
NetC515_2: C515.2 IC501.6(INP) R515.2
NetC516_1: C516.1 C517.2 R513.1 R514.2
NetC517_1: C517.1 C519.2 R519.1 R520.2
NetC518_2: C518.2 IC503.2(IN) R511.1 R521.1
NetC520_1: C520.1 IC504.1(-) R519.2 R522.1
NetC520_2: C520.2 IC504.4(Out) R518.1 R522.2
NetC528_1: C528.1 IC505.8(+) R523.1 R525.2
NetC528_2: C528.2 IC505.5(Out) R523.2 R524.1
NetC529_1: C529.1 C530.2 R525.1 R526.2
NetC530_1: C530.1 C532.2 R529.1 R530.2
NetC531_1: C531.1 IC506.8(+) R527.1 R532.2
NetC531_2: C531.2 IC506.5(Out) R527.2 R531.1
NetC533_1: C533.1 IC505.1(-) R529.2 R534.1
NetC533_2: C533.2 IC505.4(Out) R528.1 R534.2
NetC534_1: C534.1 C535.2 R532.1 R533.2
NetC535_1: C535.1 C536.2 R536.1 R537.2
NetC537_1: C537.1 IC506.1(-) R536.2 R539.1
NetC537_2: C537.2 IC506.4(Out) R535.1 R539.2
NetC538_1: C538.1 IC507.8(+) R538.1 R541.2
NetC538_2: C538.2 IC507.5(Out) R538.2 R540.1
NetC539_1: C539.1 C540.2 R541.1 R542.2
NetC540_1: C540.1 C541.2 R544.1 R545.2
NetC542_1: C542.1 IC507.1(-) R544.2 R546.1
NetC542_2: C542.2 IC507.4(Out) R543.1 R546.2
NetIC503_6: IC503.6(OUTN) R520.1
NetIC503_7: IC503.7(OUTP) R514.1

### Layout directives
net class L: 1P5V, M1

### Notes on the sheet
- ACHTUNG: P & N vertauscht!
- (near R506) ±4V
- (near IC501) Alternative: AMC3302 (±50mV)
- V=2
- (near IC501) V=8,2 / 10mOhm
  -----------------------------
  25A =>250mV => 2,05V
  => 6,25W
- (near R512) ACHTUNG: P & N vertauscht!
- 10K/499K => 2V => 101,8V
- (near R518) ±4V
- Vin = 48V (max. 80V)
- Cin = 12 x 22 µF + 7 x 22 µF + 3 x 11 µF =  451 µF
- (near R524) ACHTUNG: P & N vertauscht!
- (near R528) ±4V
- (near R531) ACHTUNG: P & N vertauscht!
- (near R535) ±4V
- (near R540) ACHTUNG: P & N vertauscht!
- (near R543) ±4V
- Title
- Size:
- Date:
- A4
- Projekt:
- Sheet
- Revision:
- of
- File:

### Library data of the parts
C501-C554 CF501-CF514 = Cap_SMD: Capacitor (SMD); Class I: Pasiv; Class II: Capacitor; Last edited: 20.11.2006 10:25
  C501 C508 C509 C518 C520 C528 C531 C533 C537 C538 C542: value: 22pF
  C502 C512 C514 CF501 CF502 CF504 CF505 CF507-CF514: value: 100nF
  C503 C504 C507 C516 C517 C519 C529 C530 C532 C534-C536 C539-C541: value: 2n2F
  C505 C510: value: 1µF/25V
  C506 C511 C513: value: 1nF
  C515: value: 8n2F
  C521-C527 C543-C554: value: 22µF/100V
  CF503 CF506: value: 1µF/10V
IC501 = AMC3301DWE: as IC403 on sheet 1166V31-4; Class I: Isolated Amplifier; Datasheet: Unknown; Package reference: SOIC-16-W
IC502 IC504-IC507 = ADA4940-1ARZ: as IC413 on sheet 1166V31-4; Class II: Fully Differential ADC Drivers (-40-125°C); Datasheet: DSO11449, Ver. Aug 2000; Last edited: 04.01.2007 10:14; Package Reference: SOIC-N-8
IC503 = AMC1311BQDWVRQ1: as IC412 on sheet 1166V31-4; Class I: Isolated Amplifier; Datasheet: Unknown; Package reference: SOIC-8-W
J501 = FCR7350R Rot: Labor Winkelbuchsen 4mm Rot; Manufacturer: CLIFF Electronic; Class I: Connectors; Best.-Nr.: Farnell: 185-4508; Class II: Labor Winkelbuchsen 4mm Rot; Last edited: 07.03.2007 13:28
J502 = FCR7350L Blau: Labor Winkelbuchsen 4mm Blau; Manufacturer: CLIFF Electronic; Class I: Connectors; Best.-Nr.: Farnell: 185-4511; Class II: Labor Winkelbuchsen 4mm Blau; Last edited: 07.03.2007 13:28
R501-R516 R518-R546 = Res_SMD: Resistor SMD; Class I: Pasiv; Class II: Resistor; Last edited: 17.11.2006 11:38
  R501 R509 R510 R522 R523 R527 R534 R538 R539 R546: value: 2K
  R502: value: 10K
  R503 R505 R506 R508 R512 R514 R518 R520 R524 R526 R528 R530 R531 R533 R535 R537 R540 R542 R543 R545: value: 49R9
  R504 R507 R513 R519 R525 R529 R532 R536 R541 R544: value: 1K
  R511: value: 499K/0,1%/10ppm/100V
  R515 R516: value: 10R
  R521: value: 10K/0,1%/10ppm
R517 = GMR320HJBFA10L0: as R419 on sheet 1166V31-4; Last edited: 23.11.2006 14:12; value: 0.010R

## Nets that join several sheets
1P5V: 1166V31-2 (16 pins), 1166V31-5 (CF505.1 CF506.1 IC503.1)
3V3: 1166V31-1 (29 pins), 1166V31-2 (26 pins), 1166V31-3 (26 pins), 1166V31-4 (26 pins), 1166V31-5 (12 pins)
5V: 1166V31-1 (C106.2 C107.2 L102.2), 1166V31-2 (CF213.1 IC213.3 IC213.7), 1166V31-3 (CF313.1 IC313.3 IC313.7), 1166V31-4 (CF413.1 IC413.3 IC413.7), 1166V31-5 (15 pins)
DC: 1166V31-2 (20 pins), 1166V31-3 (20 pins), 1166V31-4 (20 pins), 1166V31-5 (22 pins)
GND: 1166V31-1 (90 pins), 1166V31-2 (34 pins), 1166V31-3 (34 pins), 1166V31-4 (34 pins), 1166V31-5 (28 pins)
M1: 1166V31-2 (59 pins), 1166V31-5 (6 pins)
MP: 1166V31-1 (JX101.1 JX102.1 JX103.1 JX104.1), 1166V31-2 (8 pins), 1166V31-3 (8 pins), 1166V31-4 (8 pins), 1166V31-5 (20 pins)
P24V: 1166V31-1 (D101.2 J101.2 J103.5 J103.6), 1166V31-2 (C206.2 C226.2 L201.1 L203.1), 1166V31-3 (C306.2 C326.2 L301.1 L303.1), 1166V31-4 (C406.2 C426.2 L401.1 L403.1)
Ref_2V5: 1166V31-1 (5 pins), 1166V31-2 (CF212.1 IC213.2), 1166V31-3 (CF312.1 IC313.2), 1166V31-4 (CF412.1 IC413.2), 1166V31-5 (10 pins)
GaN_H1_FAULT: 1166V31-1 (IC101.12 J103.50), 1166V31-2 (IC205.6 R201.2)
GaN_H1_OT: 1166V31-1 (IC101.10 J103.46), 1166V31-2 (IC205.4 R202.2)
GaN_H1_Temp: 1166V31-1 (J103.30), 1166V31-2 (IC214.5)
GaN_H2_FAULT: 1166V31-1 (IC105.12 J103.74), 1166V31-3 (IC305.6 R301.2)
GaN_H2_OT: 1166V31-1 (IC105.10 J103.70), 1166V31-3 (IC305.4 R302.2)
GaN_H2_Temp: 1166V31-1 (J103.54), 1166V31-3 (IC314.5)
GaN_H3_FAULT: 1166V31-1 (IC109.12 J103.73), 1166V31-4 (IC405.6 R401.2)
GaN_H3_OT: 1166V31-1 (IC109.10 J103.69), 1166V31-4 (IC405.4 R402.2)
GaN_H3_Temp: 1166V31-1 (J103.53), 1166V31-4 (IC414.5)
GaN_L1_FAULT: 1166V31-1 (IC101.4 J103.42), 1166V31-2 (IC210.6 R203.2)
GaN_L1_OT: 1166V31-1 (IC101.2 J103.38), 1166V31-2 (IC210.4 R207.2)
GaN_L1_Temp: 1166V31-1 (J103.34), 1166V31-2 (IC216.5)
GaN_L2_FAULT: 1166V31-1 (IC105.4 J103.66), 1166V31-3 (IC310.6 R303.2)
GaN_L2_OT: 1166V31-1 (IC105.2 J103.62), 1166V31-3 (IC310.4 R307.2)
GaN_L2_Temp: 1166V31-1 (J103.58), 1166V31-3 (IC316.5)
GaN_L3_FAULT: 1166V31-1 (IC109.4 J103.65), 1166V31-4 (IC410.6 R404.2)
GaN_L3_OT: 1166V31-1 (IC109.2 J103.61), 1166V31-4 (IC410.4 R407.2)
GaN_L3_Temp: 1166V31-1 (J103.57), 1166V31-4 (IC416.5)
I1_DIAG: 1166V31-1 (J103.29), 1166V31-2 (IC203.14 R204.1)
I1_OUT_N: 1166V31-1 (J102.2), 1166V31-5 (R528.2)
I1_OUT_N#: 1166V31-2 (IC203.10), 1166V31-5 (R530.1)
I1_OUT_P: 1166V31-1 (J102.1), 1166V31-5 (R524.2)
I1_OUT_P#: 1166V31-2 (IC203.11), 1166V31-5 (R526.1)
I2_DIAG: 1166V31-1 (J103.33), 1166V31-3 (IC303.14 R304.1)
I2_OUT_N: 1166V31-1 (J102.6), 1166V31-5 (R543.2)
I2_OUT_N#: 1166V31-3 (IC303.10), 1166V31-5 (R545.1)
I2_OUT_P: 1166V31-1 (J102.3), 1166V31-5 (R540.2)
I2_OUT_P#: 1166V31-3 (IC303.11), 1166V31-5 (R542.1)
I3_DIAG: 1166V31-1 (J103.37), 1166V31-4 (IC403.14 R403.1)
I3_OUT_N: 1166V31-1 (J102.5), 1166V31-5 (R535.2)
I3_OUT_N#: 1166V31-4 (IC403.10), 1166V31-5 (R537.1)
I3_OUT_P: 1166V31-1 (J102.4), 1166V31-5 (R531.2)
I3_OUT_P#: 1166V31-4 (IC403.11), 1166V31-5 (R533.1)
I_DIAG: 1166V31-1 (J103.41), 1166V31-5 (IC501.14 R502.1)
I_OUT_N: 1166V31-1 (J104.8), 1166V31-5 (R506.2)
I_OUT_P: 1166V31-1 (J104.7), 1166V31-5 (R503.2)
PWM_EN: 1166V31-1 (8 pins), 1166V31-2 (IC204.12 IC209.12), 1166V31-3 (IC304.12 IC309.12), 1166V31-4 (IC404.12 IC409.12)
PWM_H1: 1166V31-1 (IC101.6 IC104.3 TP101.1), 1166V31-2 (R212.2)
PWM_H2: 1166V31-1 (IC105.6 IC108.3 TP103.1), 1166V31-3 (R312.2)
PWM_H3: 1166V31-1 (IC109.6 IC113.3 TP105.1), 1166V31-4 (R412.2)
PWM_L1: 1166V31-1 (IC101.8 IC104.1 TP102.1), 1166V31-2 (R226.2)
PWM_L2: 1166V31-1 (IC105.8 IC108.1 TP104.1), 1166V31-3 (R326.2)
PWM_L3: 1166V31-1 (IC109.8 IC113.1 TP106.1), 1166V31-4 (R426.2)
U_DC_N: 1166V31-1 (J102.8), 1166V31-5 (R518.2)
U_DC_P: 1166V31-1 (J102.7), 1166V31-5 (R512.2)
U_L1_N: 1166V31-1 (J104.2), 1166V31-2 (R236.2)
U_L1_P: 1166V31-1 (J104.1), 1166V31-2 (R232.2)
U_L2_N: 1166V31-1 (J104.6), 1166V31-3 (R336.2)
U_L2_P: 1166V31-1 (J104.3), 1166V31-3 (R332.2)
U_L3_N: 1166V31-1 (J104.5), 1166V31-4 (R436.2)
U_L3_P: 1166V31-1 (J104.4), 1166V31-4 (R432.2)

## Assembly variants
Variant V31: not fitted J101 J103 JX101 JX102 JX103 JX104 KIng101 P101 PM101 PM102 PM103 PM104 PM105 PM106 R102 R104 TP101 TP102 TP103 TP104 TP105 TP106 TP107